# Altium schematic sheet base.SchDoc
size A4
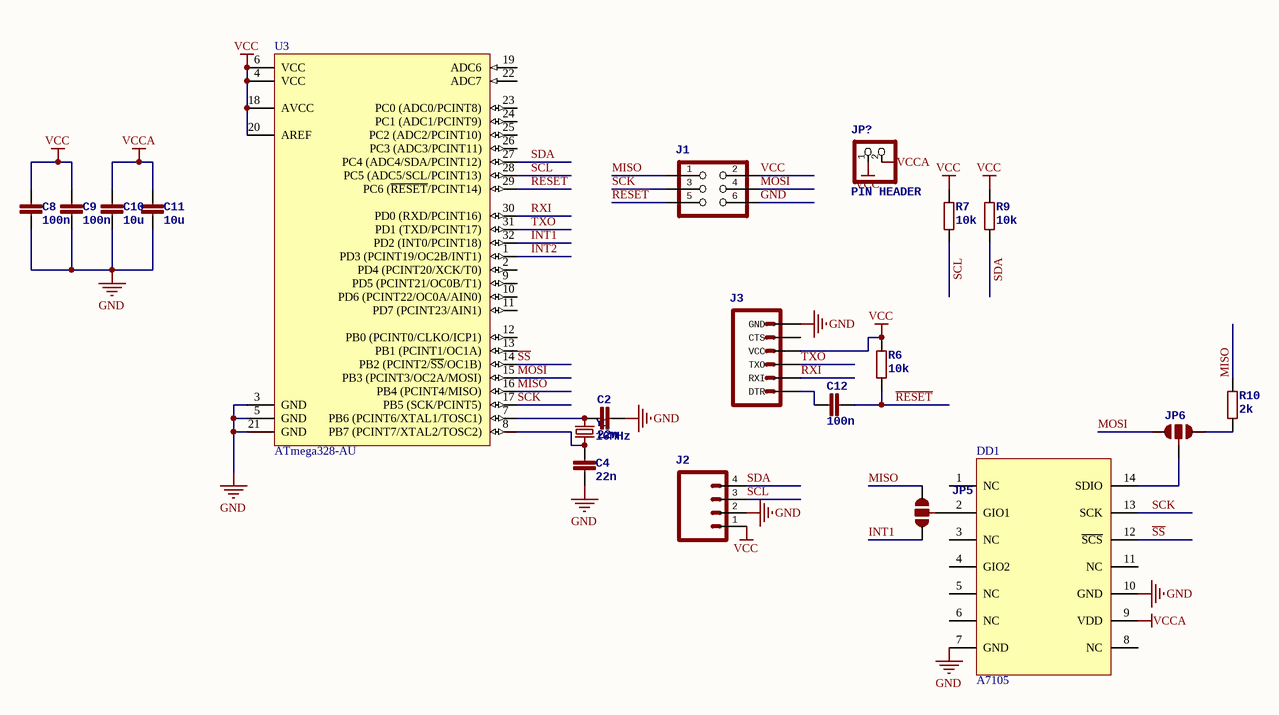
[diagram p0: base.SchDoc]

## Parts
C2  22n  [C0805K]
C4  22n  [C0805K]
C8  100n  [C0805K]
C9  100n  [C0805K]
C10  10u  [C0805K]
C11  10u  [C0805K]
C12  100n  [C0805K]
DD1  A7105  [A7105]
J1  (no value)  [2X3-NS]
J2  (no value)  [1X04_NO_SILK]
J3  (no value)  [1X06_LONGPADS]
JP5  (no value)  [PAD-JUMPER-3-NO_YES_SILK_FULL_BOX]
JP6  (no value)  [PAD-JUMPER-3-NO_YES_SILK_FULL_BOX]
JP?  PIN HEADER  [1X02/90]
R6  10k  [R0805]
R7  10k  [R0805]
R9  10k  [R0805]
R10  2k  [R0805]
U3  ATmega328-AU  [32A_N]
Y1  16MHz  [HC49UP]

## Nets
GND: C2.2 C4.1 C8.2 C9.2 C10.2 C11.2 DD1.7(GND) DD1.10(GND) J1.6 J2.2 J3.6(GND) U3.3(GND) U3.5(GND) U3.21(GND)
VCC: C8.1 C9.1 J1.2 J2.1 J3.4(VCC) JP?.1 R6.2 R7.2 R9.2 U3.4(VCC) U3.6(VCC) U3.18(AVCC) U3.20(AREF)
VCCA: C10.1 C11.1 DD1.9(VDD) JP?.2
INT1: JP5.1 U3.32(PD2_(INT0/PCINT18))
INT2: U3.1(PD3_(PCINT19/OC2B/INT1))
MISO: J1.1 JP5.3 R10.2 U3.16(PB4_(PCINT4/MISO))
MOSI: J1.4 JP6.1 U3.15(PB3_(PCINT3/OC2A/MOSI))
~{RESET}: C12.2 J1.5 R6.1 U3.29(PC6_(~{RESET}/PCINT14))
RXI: J3.2(RXI) U3.30(PD0_(RXD/PCINT16))
~{SS}: DD1.12(~{SCS}) U3.14(PB2_(PCINT2/~{SS}/OC1B))
SCK: DD1.13(SCK) J1.3 U3.17(PB5_(SCK/PCINT5))
SCL: J2.3 R7.1 U3.28(PC5_(ADC5/SCL/PCINT13))
SDA: J2.4 R9.1 U3.27(PC4_(ADC4/SDA/PCINT12))
TXO: J3.3(TXO) U3.31(PD1_(TXD/PCINT17))
NetC2_1: C2.1 U3.7(PB6_(PCINT6/XTAL1/TOSC1)) Y1.2
NetC4_2: C4.2 U3.8(PB7_(PCINT7/XTAL2/TOSC2)) Y1.1
NetC12_1: C12.1 J3.1(DTR)
NetDD1_2: DD1.2(GIO1) JP5.2
NetDD1_14: DD1.14(SDIO) JP6.2
NetJP6_3: JP6.3 R10.1

Not connected (* = marked no-connect by the designer): DD1 1(NC) 3(NC) 4(GIO2) 5(NC) 6(NC) 8(NC) 11(NC); J3 5(CTS); U3 2(PD4_(PCINT20/XCK/T0)) 9(PD5_(PCINT21/OC0B/T1)) 10(PD6_(PCINT22/OC0A/AIN0)) 11(PD7_(PCINT23/AIN1)) 12(PB0_(PCINT0/CLKO/ICP1)) 13(PB1_(PCINT1/OC1A)) 19(ADC6) 22(ADC7) 23(PC0_(ADC0/PCINT8)) 24(PC1_(ADC1/PCINT9)) 25(PC2_(ADC2/PCINT10)) 26(PC3_(ADC3/PCINT11))

## Library data of the parts
C2 C4 C8-C12 = C-EUC0805K
DD1 = Component_1
J1 = AVR_SPI_PRG_6NS
J2 = I2C_STANDARD_NO_SILK
J3 = ARDUINO_SERIAL_PROGRAMLONGPADS
JP5 JP6 = JUMPER-PAD-3-NOFULL_BOX_SILK
JP? = PINHD-1X2/90
R6 R7 R9 R10 = R-EU_R0805
U3 = ATmega328-AU: 8-bit AVR Microcontroller, 32KB Flash, 1KB EEPROM, 2KB SRAM, 32-pin TQFP, Industrial Grade (-40°C to 85°C); DatasheetVersion: revD, May-2011; PackageVersion: revC, Oct-2010; PackageReference: 32A; PackageDescription: 32-Lead, 7x7x1.0 mm Body, 0.8mm Lead Pitch, Thin Profile Plastic Quad Flat Package (TQFP); Code_JEDEC: MS-026-ABA; ComponentLink1Description: Manufacturer URL; ComponentLink1URL: http://www.atmel.com/; ComponentLink2Description: ATmega48A/48PA/88A/88PA/168A/168PA/328/328P Datasheet; ComponentLink2URL: http://www.atmel.com/dyn/resources/prod_documents/doc8271.pdf; ComponentLink3Description: ATmega48A/48PA/88A/88PA/168A/168PA/328/328P Summary; ComponentLink3URL: http://www.atmel.com/dyn/resources/prod_documents/8271S.pdf
Y1 = CRYSTALSMD